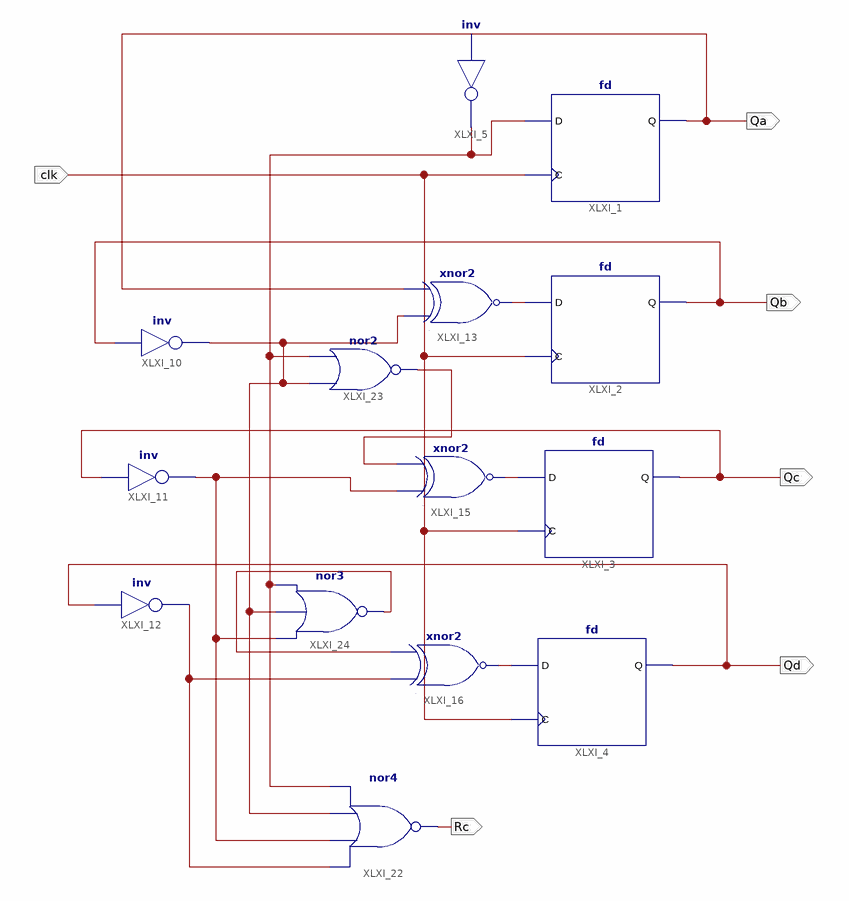
[diagram p0: schematic sheet 1]
// Xilinx ISE schematic Counter4b.sch (kintex7) as structural Verilog: 14 symbols, 6 ports
module Counter4b (
  input  clk,
  output Qa,
  output Qb,
  output Qc,
  output Qd,
  output Rc
);

  wire XLXN_9, XLXN_10, XLXN_11, XLXN_20, XLXN_21, XLXN_26, XLXN_29, XLXN_30, XLXN_31;

  fd XLXI_1 (.C(clk), .D(XLXN_20), .Q(Qa));
  fd XLXI_2 (.C(clk), .D(XLXN_9), .Q(Qb));
  fd XLXI_3 (.C(clk), .D(XLXN_10), .Q(Qc));
  fd XLXI_4 (.C(clk), .D(XLXN_11), .Q(Qd));
  not XLXI_5 (XLXN_20, Qa);
  not XLXI_10 (XLXN_21, Qb);
  not XLXI_11 (XLXN_26, Qc);
  not XLXI_12 (XLXN_31, Qd);
  xnor XLXI_13 (XLXN_9, XLXN_21, Qa);
  xnor XLXI_15 (XLXN_10, XLXN_26, XLXN_30);
  xnor XLXI_16 (XLXN_11, XLXN_31, XLXN_29);
  nor XLXI_22 (Rc, XLXN_31, XLXN_26, XLXN_21, XLXN_20);
  nor XLXI_23 (XLXN_30, XLXN_21, XLXN_20);
  nor XLXI_24 (XLXN_29, XLXN_26, XLXN_21, XLXN_20);
endmodule
